# Altium project Current Loop.PrjPcb
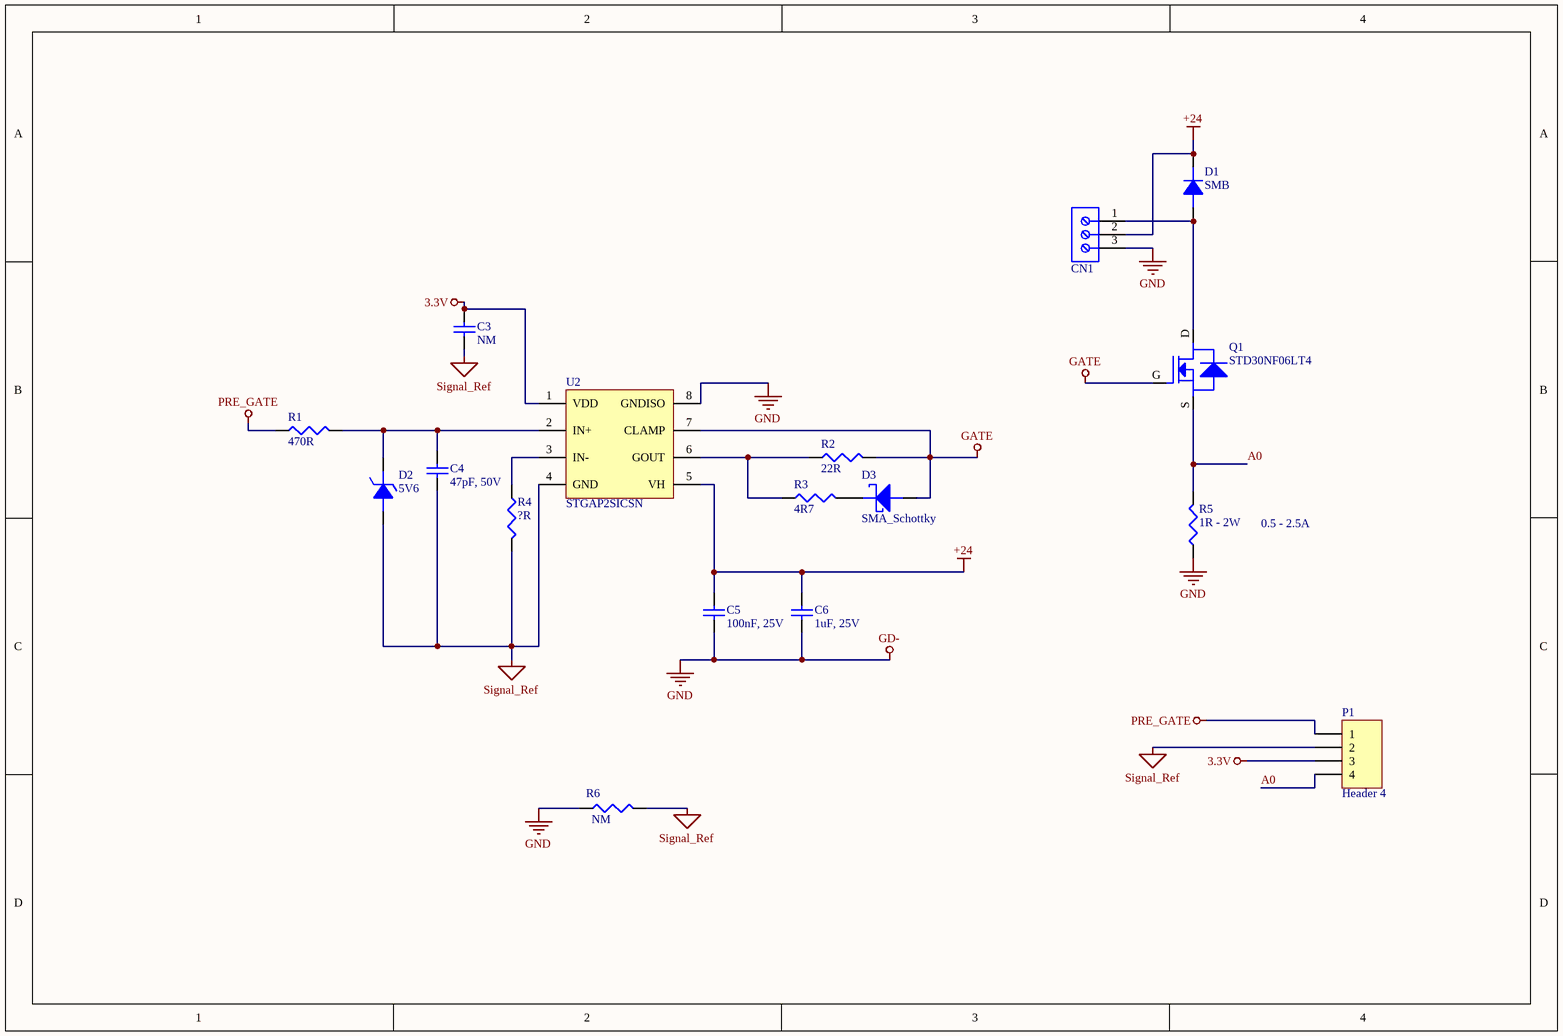
[diagram p0: Current Loop.SchDoc]
1 sheet, 17 parts. Net scope: global (net labels, ports and power ports of the same name join across sheets).
Board file: Current Loop.PcbDoc

## Sheet Current Loop.SchDoc
size A4

### Parts
C3  NM  [WCAP-CSGP_0603_H=0.8mm_Reflow]
C4  47pF, 50V  [WCAP-CSGP_0805_H=0.6mm_Reflow]
C5  100nF, 25V  [WCAP-CSGP_0805_H=0.8mm_Reflow]
C6  1uF, 25V  [WCAP-CSGP_0805_H=1.25mm]
CN1  691216710003  [691216710003]  (value not drawn)
D1  SMB  [SMB]
D2  5V6  [SOD80]
D3  SMA_Schottky  [SMA]
P1  Header 4  [HDR1X4]
Q1  STD30NF06LT4  [NFET_DPAK]
R1  470R  [SM/R_0805]
R2  22R  [SM/R_0805]
R3  4R7  [SM/R_0805]
R4  ?R  [SM/R_0805]
R5  1R - 2W  [SM/R_2512]
R6  NM  [SM/R_0805]
U2  STGAP2SICSN  [SO8_N]

### Nets
3.3V: C3.2 P1.3 U2.1(VDD)
+24: C5.2 C6.2 CN1.2 D1.K(CATHODE) U2.5(VH)
GATE: D3.A Q1.G(GATE) R2.2 U2.7(CLAMP)
GD-: C5.1 C6.1 CN1.3 R5.1 R6.1 U2.8(GNDISO)  [also labelled GND]
PRE_GATE: P1.1 R1.1
Signal_Ref: C3.1 C4.1 D2.A(ANODE) P1.2 R4.2 R6.2 U2.4(GND)
A0: P1.4 Q1.S(SOURCE) R5.2
NetC4_2: C4.2 D2.K(CATHODE) R1.2 U2.2(IN+)
NetCN1_1: CN1.1 D1.A(ANODE) Q1.D(DRAIN)
NetD3_K: D3.K R3.2
NetR2_1: R2.1 R3.1 U2.6(GOUT)
NetR4_1: R4.1 U2.3(IN-)

### Notes on the sheet
- 0.5 - 2.5A

### Library data of the parts
C3 = 885012206071: WCAP-CSGP Multilayer Ceramic Chip Capacitor, General Purpose, size 0603, X7R, 100nF, 25V; Manufacturer: Wurth Elektronik; Rated Voltage: 25VDC; Isolation Resistance: >=5GOhm; Capacitance Tolerance: +/-10%; Technical Reference: X7R0603104K025DFCT10000; ComponentLink1Description: Manufacturer; ComponentLink1URL: http://www.we-online.de; ComponentLink2Description: Datasheet; ComponentLink2URL: https://www.we-online.com/catalog/datasheet/885012206071.pdf; Operating Temperature: -55 to +125degC; Packaging: Tape and Reel; Manufacturer Part Number: 885012206071; Published Date: May 2020; Ceramic Type: X7R; Dissipation Factor: =<3.5%; Height: 0.8mm; Mounting Technology: SMT; Size: 0603; Capacitance: 100nF
C4 = 885012007055: WCAP-CSGP Multilayer Ceramic Chip Capacitor, General Purpose, size 0805, NP0, 47pF, 50V; Manufacturer: Wurth Elektronik; Rated Voltage: 50VDC; Isolation Resistance: >=10GOhm; Capacitance Tolerance: +/-5%; Dissipation Factor: Q>=1000; Technical Reference: NP00805470J050DFCT10000; ComponentLink1Description: Manufacturer; ComponentLink1URL: http://www.we-online.de; ComponentLink2Description: Datasheet; ComponentLink2URL: https://www.we-online.com/catalog/datasheet/885012007055.pdf; Operating Temperature: -55 to +125degC; Packaging: Tape and Reel; Manufacturer Part Number: 885012007055; Published Date: May 2020; Ceramic Type: NP0; Height: 0.6mm; Mounting Technology: SMT; Size: 0805; Capacitance: 47pF
C5 = 885012207072: WCAP-CSGP Multilayer Ceramic Chip Capacitor, General Purpose, size 0805, X7R, 100nF, 25V; Manufacturer: Wurth Elektronik; Rated Voltage: 25VDC; Isolation Resistance: >=5GOhm; Capacitance Tolerance: +/-10%; Technical Reference: X7R0805104K025DFCT10000; ComponentLink1Description: Manufacturer; ComponentLink1URL: http://www.we-online.de; ComponentLink2Description: Datasheet; ComponentLink2URL: https://www.we-online.com/catalog/datasheet/885012207072.pdf; Operating Temperature: -55 to +125degC; Packaging: Tape and Reel; Manufacturer Part Number: 885012207072; Published Date: May 2020; Ceramic Type: X7R; Dissipation Factor: =<3.5%; Height: 0.8mm; Mounting Technology: SMT; Size: 0805; Capacitance: 100nF
C6 = 885012207078: WCAP-CSGP Multilayer Ceramic Chip Capacitor, General Purpose, size 0805, X7R, 1uF, 25V; Manufacturer: Wurth Elektronik; Rated Voltage: 25VDC; Isolation Resistance: >=0.5GOhm; Capacitance Tolerance: +/-10%; Technical Reference: X7R0805105K025DFCT10000; ComponentLink1Description: Manufacturer; ComponentLink1URL: http://www.we-online.de; ComponentLink2Description: Datasheet; ComponentLink2URL: https://www.we-online.com/catalog/datasheet/885012207078.pdf; Operating Temperature: -55 to +125degC; Packaging: Tape and Reel; Manufacturer Part Number: 885012207078; Published Date: May 2020; Ceramic Type: X7R; Dissipation Factor: =<5%; Height: 1.25mm; Mounting Technology: SMT; Size: 0805; Capacitance: 1uF
CN1 = 691216710003: WR-TBL Serie 2167 Horizontal Entry Modular, Rising Cage Clamp, pitch 5mm, 3p; Compliance: Lead free / RoHS;​ ROHS & Reach; Modularity: Yes; PCB/Cable/Panel: PCB; Pin Number: 3; Rated Current [UL]: 14A; Working Voltage [UL]: 300VAC; ComponentLink1Description: Manufacturer; ComponentLink1URL: http://www.we-online.de; ComponentLink2URL: https://katalog.we-online.de/em/datasheet/691216710003.pdf; ComponentLink2Description: Datasheet; Mounting Technology: THT; Part Number: 691216710003; Packaging: Box; Operating Temperature: -30 to +120degC; Pitch: 5mm; Published Date: October 2019; Type: Horizontal; Publisher: Wurth Elektronik; Application: Rising Cage Clamp
D1 = SMB: Manufacturer: STMicroelectronics
D2 = SOD80_zener
D3 = SMA_Schottky: Value/Generic Part Number: Schottky Diode; Package/Class: SM
P1 = Header 4: Header, 4-Pin; LatestRevisionDate: 17-Jul-2002; LatestRevisionNote: Re-released for DXP Platform.; Publisher: Altium Limited
Q1 = NFET: Manufacturer: STMicroelectronics; Package/Class: SM; Mfg P/N: NFET_D2PAK; Value/Generic Part Number: NFET_DPAK
R1-R6 = SMRes: Mounting: SMD
  R1-R4 R6: RoHS: Yes; Category: Chip SMD Resistors; Stock 1: 1; Pricing 1: 10=0.67400, 100=0.52000, 250=0.49300, 500=0.33100, 1000=0.28900 (USD); Mount: Surface Mount; Number of Pins: 2; Resistor Type: FIXED RESISTOR
U2 = STGAP2S: Galvanically isolated 4 A single gate driver